# Altium schematic sheet Sheet2.SchDoc
size A3; SheetNumber: 1; SheetTotal: 1
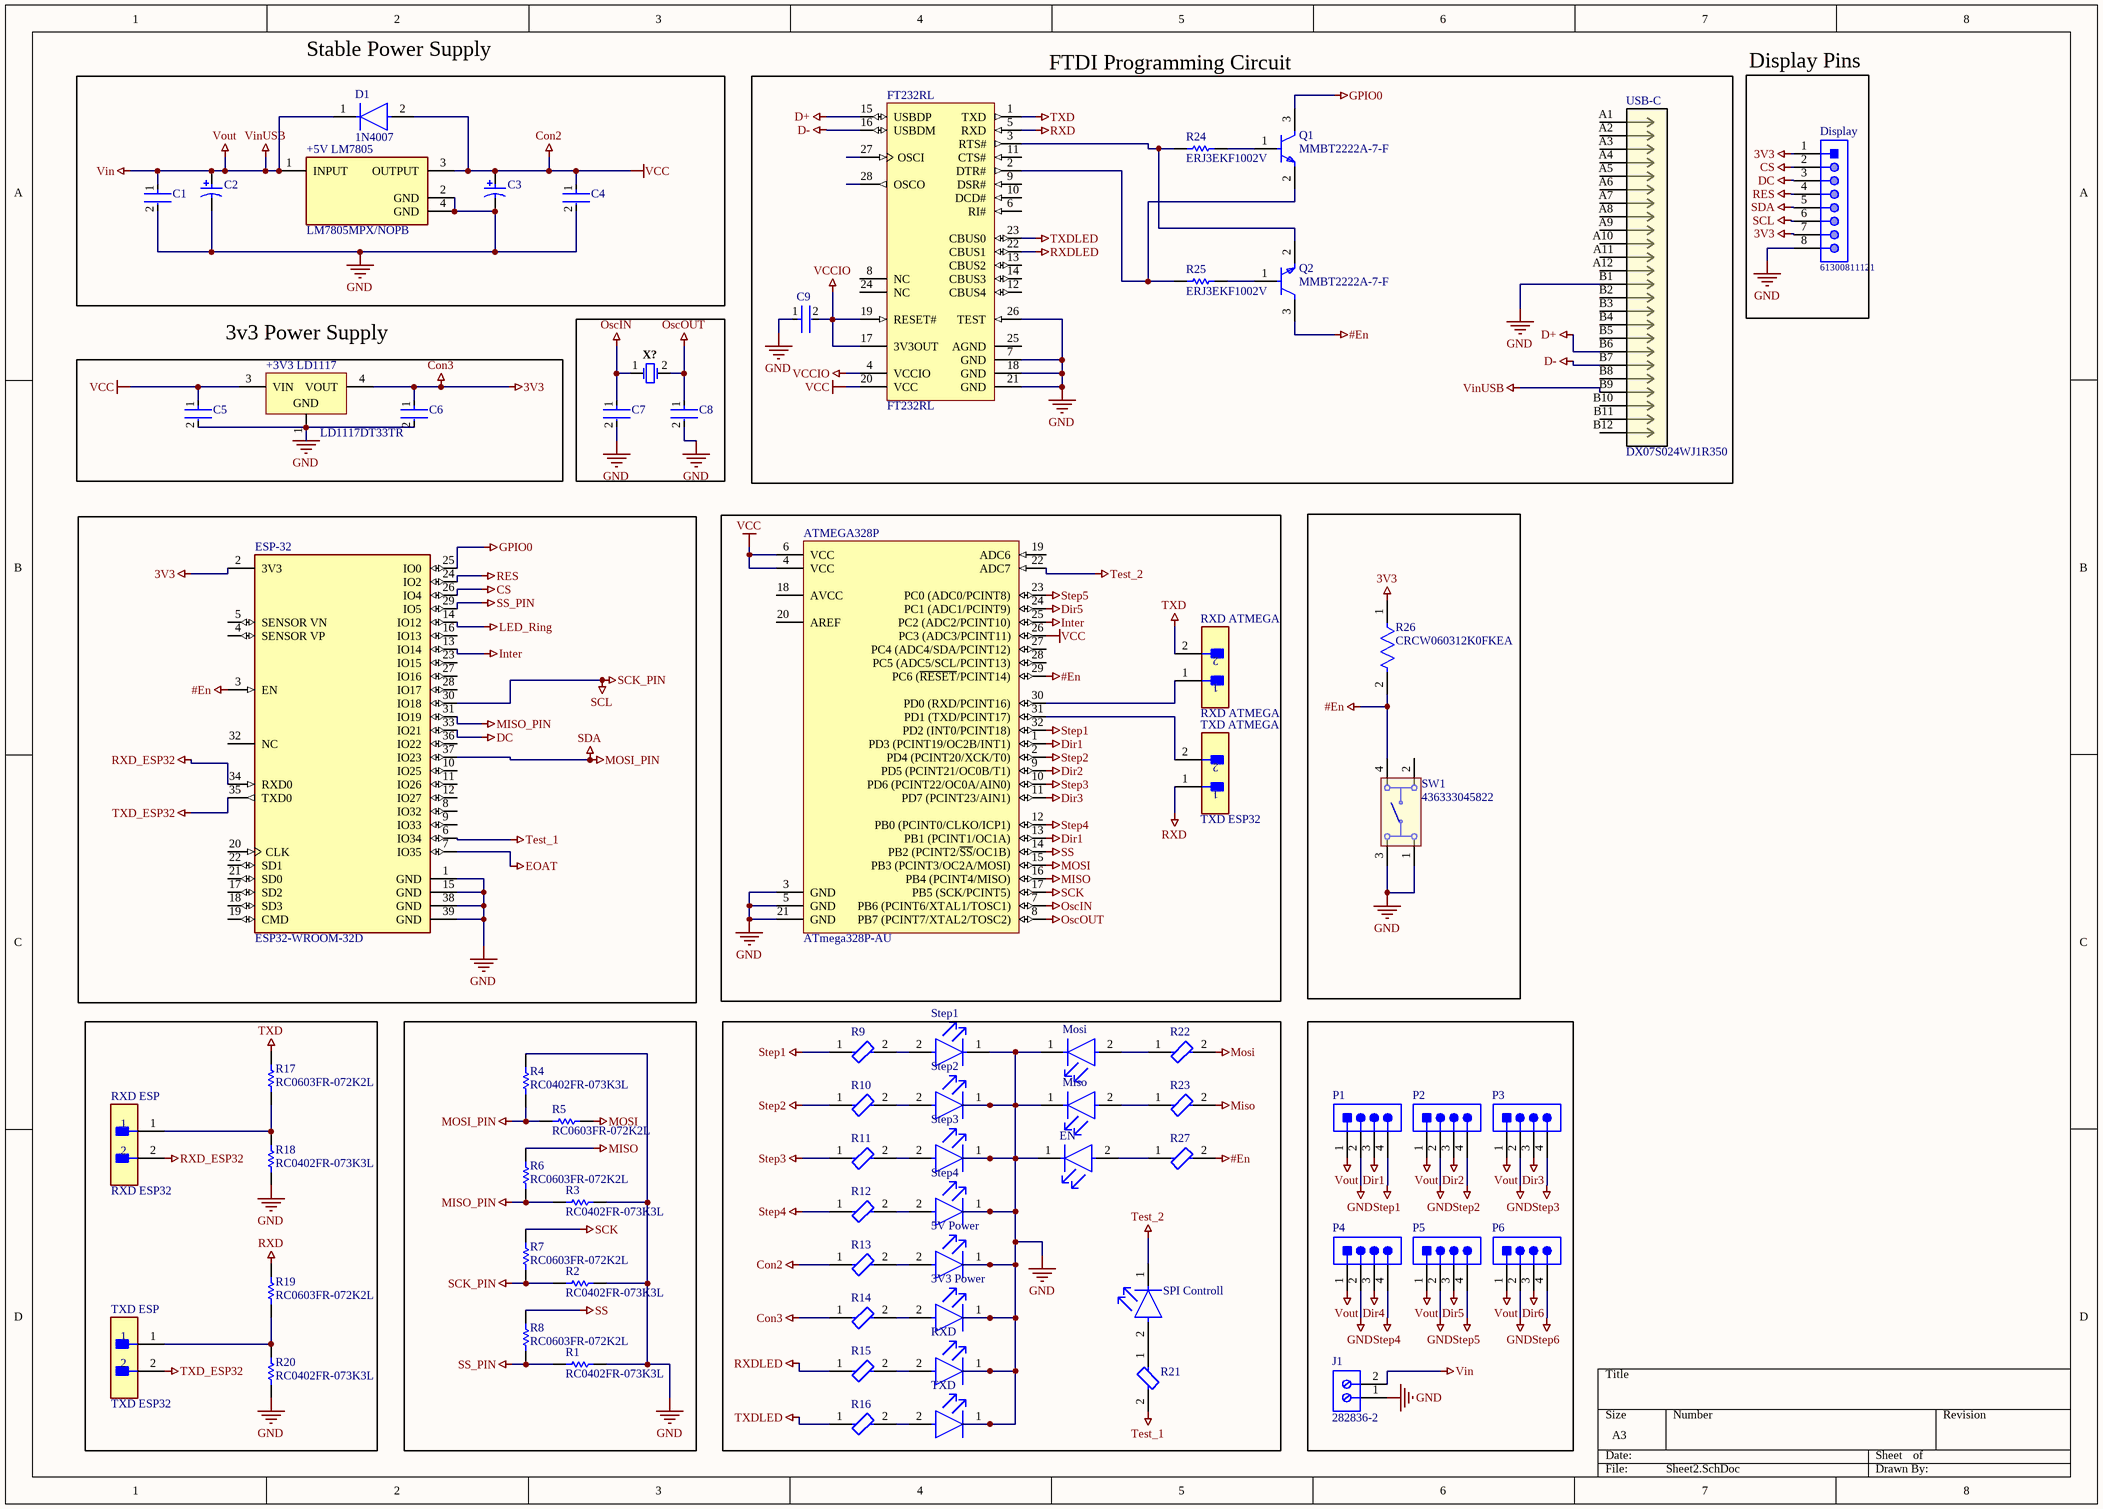
[diagram p0: Sheet2.SchDoc]

## Parts
3V3_Power  (no value)  [FP-150080SS75000-MFG]
5V_Power  (no value)  [FP-150080SS75000-MFG]
+3V3_LD1117  LD1117DT33TR  [TO-252_N]
+5V_LM7805  LM7805MPX/NOPB  [FP-LM7805MPX-NOPB-MFG]
ATMEGA328P  ATmega328P-AU  [32A_M]
C1  (no value)  [FP-CGA3E-0_3-0_1-IPC_A]
C2  (no value)  [NIC-UCL-10x13.5-2_V]
C3  (no value)  [NIC-UCL-10x13.5-2_V]
C4  (no value)  [FP-CGA3E-0_3-0_1-IPC_A]
C5  (no value)  [FP-CGA3E-0_3-0_1-IPC_A]
C6  (no value)  [FP-CGA3E-0_3-0_1-IPC_A]
C7  (no value)  [FP-C0603C-CF-MFG]
C8  (no value)  [FP-C0603C-CF-MFG]
C9  (no value)  [FP-CGA3E-0_3-0_1-IPC_A]
D1  1N4007  [FP-1N4007-MFG]
Display  61300811121  [61300811121]
EN  (no value)  [FP-150080SS75000-MFG]
ESP-32  ESP32-WROOM-32D  [FP-ESP32-WROOM-32D-MFG]
FT232RL  FT232RL  [FTDI-SSOP-28_M]
J1  282836-2  [TECO-282836-2_V]
Miso  (no value)  [FP-150080SS75000-MFG]
Mosi  (no value)  [FP-150080SS75000-MFG]
P1  (no value)  [JST-B4B-PH-K-S_V]
P2  (no value)  [JST-B4B-PH-K-S_V]
P3  (no value)  [JST-B4B-PH-K-S_V]
P4  (no value)  [JST-B4B-PH-K-S_V]
P5  (no value)  [JST-B4B-PH-K-S_V]
P6  (no value)  [JST-B4B-PH-K-S_V]
Q1  MMBT2222A-7-F  [FP-SOT23-IPC_A]
Q2  MMBT2222A-7-F  [FP-SOT23-IPC_A]
R1  RC0402FR-073K3L  [RESC1005X40X25ML05T10]
R2  RC0402FR-073K3L  [RESC1005X40X25ML05T10]
R3  RC0402FR-073K3L  [RESC1005X40X25ML05T10]
R4  RC0402FR-073K3L  [RESC1005X40X25ML05T10]
R5  RC0603FR-072K2L  [RESC1608X55X25LL10T15]
R6  RC0603FR-072K2L  [RESC1608X55X25LL10T15]
R7  RC0603FR-072K2L  [RESC1608X55X25LL10T15]
R8  RC0603FR-072K2L  [RESC1608X55X25LL10T15]
R9  (no value)  [FP-BLM18-0_15-t0_5-MFG]
R10  (no value)  [FP-BLM18-0_15-t0_5-MFG]
R11  (no value)  [FP-BLM18-0_15-t0_5-MFG]
R12  (no value)  [FP-BLM18-0_15-t0_5-MFG]
R13  (no value)  [FP-BLM18-0_15-t0_5-MFG]
R14  (no value)  [FP-BLM18-0_15-t0_5-MFG]
R15  (no value)  [FP-BLM18-0_15-t0_5-MFG]
R16  (no value)  [FP-BLM18-0_15-t0_5-MFG]
R17  RC0603FR-072K2L  [RESC1608X55X25LL10T15]
R18  RC0402FR-073K3L  [RESC1005X40X25ML05T10]
R19  RC0603FR-072K2L  [RESC1608X55X25LL10T15]
R20  RC0402FR-073K3L  [RESC1005X40X25ML05T10]
R21  (no value)  [FP-BLM18-0_15-t0_5-MFG]
R22  (no value)  [FP-BLM18-0_15-t0_5-MFG]
R23  (no value)  [FP-BLM18-0_15-t0_5-MFG]
R24  ERJ3EKF1002V  [RESC1609X55X30LL15T15]
R25  ERJ3EKF1002V  [RESC1609X55X30LL15T15]
R26  CRCW060312K0FKEA  [FP-CRCW0603-e3-IPC_A]
R27  (no value)  [FP-BLM18-0_15-t0_5-MFG]
RXD  (no value)  [FP-150080SS75000-MFG]
RXD_ATMEGA  RXD ATMEGA  [FP-M22-2510205-MFG]
RXD_ESP  RXD ESP32  [FP-M22-2510205-MFG]
SPI_Controll  (no value)  [FP-150080SS75000-MFG]
Step1  (no value)  [FP-150080SS75000-MFG]
Step2  (no value)  [FP-150080SS75000-MFG]
Step3  (no value)  [FP-150080SS75000-MFG]
Step4  (no value)  [FP-150080SS75000-MFG]
SW1  436333045822  [436333045822]
TXD  (no value)  [FP-150080SS75000-MFG]
TXD_ATMEGA  TXD ESP32  [FP-M22-2510205-MFG]
TXD_ESP  TXD ESP32  [FP-M22-2510205-MFG]
USB-C  DX07S024WJ1R350  [CONN_DX07S024WJ1R350_JAE]
X?  (no value)  [FOX-FOXSLF160-20]

## Blocks framed on the sheet
Stable Power Supply: +5V_LM7805 C1-C4 D1
FTDI Programming Circuit: C9 FT232RL Q1 Q2 R24 R25 USB-C
Display Pins: Display
3v3 Power Supply: +3V3_LD1117 C5 C6

## Nets
3V3: +3V3_LD1117.4(VOUT) C6.1 Display.1 Display.7 ESP-32.2(3V3) R14.1 R26.1  [also labelled Con3]
#En: ATMEGA328P.29(PC6_(~{RESET}/PCINT14)) ESP-32.3(EN) Q2.3(C) R26.2 R27.2 SW1.4
Con2: +3V3_LD1117.3(VIN) +5V_LM7805.3(OUTPUT) ATMEGA328P.4(VCC) ATMEGA328P.6(VCC) ATMEGA328P.26(PC3_(ADC3/PCINT11)) C3.1 C4.1 C5.1 D1.2(A) FT232RL.20(VCC) R13.1  [also labelled VCC]
CS: Display.2 ESP-32.26(IO4)
D+: FT232RL.15(USBDP) USB-C.B6(B4)
D-: FT232RL.16(USBDM) USB-C.B7(A10)
DC: Display.3 ESP-32.33(IO21)
Dir1: ATMEGA328P.1(PD3_(PCINT19/OC2B/INT1)) ATMEGA328P.13(PB1_(PCINT1/OC1A)) P1.3
Dir2: ATMEGA328P.9(PD5_(PCINT21/OC0B/T1)) P2.3
Dir3: ATMEGA328P.11(PD7_(PCINT23/AIN1)) P3.3
Dir4: P4.3
Dir5: ATMEGA328P.24(PC1_(ADC1/PCINT9)) P5.3
Dir6: P6.3
EOAT: ESP-32.7(IO35)
GND: 3V3_Power.1(C) 5V_Power.1(C) +3V3_LD1117.1(GND) +5V_LM7805.2(GND) +5V_LM7805.4(GND) ATMEGA328P.3(GND) ATMEGA328P.5(GND) ATMEGA328P.21(GND) C1.2 C2.2 C3.2 C4.2 C5.2 C6.2 C7.2 C8.2 C9.1 Display.8 EN.1(C) ESP-32.1(GND) ESP-32.15(GND) ESP-32.38(GND) ESP-32.39(GND) FT232RL.7(GND) FT232RL.18(GND) FT232RL.21(GND) FT232RL.26(TEST) J1.1 Miso.1(C) Mosi.1(C) P1.2 P2.2 P3.2 P4.2 P5.2 P6.2 R1.2 R2.2 R3.2 R4.2 RXD.1(C) Step1.1(C) Step2.1(C) Step3.1(C) Step4.1(C) SW1.1 SW1.3 TXD.1(C) USB-C.B1(A7)
GPIO0: ESP-32.25(IO0) Q1.3(C)
Inter: ATMEGA328P.25(PC2_(ADC2/PCINT10)) ESP-32.13(IO14)
LED_Ring: ESP-32.14(IO12)
MISO: ATMEGA328P.16(PB4_(PCINT4/MISO)) R6.2 R23.2
MISO_PIN: ESP-32.31(IO19) R3.1 R6.1
MOSI: ATMEGA328P.15(PB3_(PCINT3/OC2A/MOSI)) R5.2 R22.2
MOSI_PIN: Display.5 ESP-32.37(IO23) R4.1 R5.1  [also labelled SDA]
OscIN: ATMEGA328P.7(PB6_(PCINT6/XTAL1/TOSC1)) C7.1 X?.1
OscOUT: ATMEGA328P.8(PB7_(PCINT7/XTAL2/TOSC2)) C8.1 X?.2
RES: Display.4 ESP-32.24(IO2)
RXD: FT232RL.5(RXD) TXD_ATMEGA.1
RXD_ESP32: ESP-32.34(RXD0) RXD_ESP.2
RXDLED: FT232RL.22(CBUS1) R15.1
SCK: ATMEGA328P.17(PB5_(SCK/PCINT5)) R7.2
SCK_PIN: Display.6 ESP-32.30(IO18) R2.1 R7.1  [also labelled SCL]
SS: ATMEGA328P.14(PB2_(PCINT2/~{SS}/OC1B)) R8.2
SS_PIN: ESP-32.29(IO5) R1.1 R8.1
Step1: ATMEGA328P.32(PD2_(INT0/PCINT18)) P1.4 R9.1
Step2: ATMEGA328P.2(PD4_(PCINT20/XCK/T0)) P2.4 R10.1
Step3: ATMEGA328P.10(PD6_(PCINT22/OC0A/AIN0)) P3.4 R11.1
Step4: ATMEGA328P.12(PB0_(PCINT0/CLKO/ICP1)) P4.4 R12.1
Step5: ATMEGA328P.23(PC0_(ADC0/PCINT8)) P5.4
Step6: P6.4
Test_1: ESP-32.6(IO34) R21.2
Test_2: ATMEGA328P.22(ADC7) SPI_Controll.1(C)
TXD: FT232RL.1(TXD) RXD_ATMEGA.2
TXD_ESP32: ESP-32.35(TXD0) TXD_ESP.2
TXDLED: FT232RL.23(CBUS0) R16.1
VCCIO: C9.2 FT232RL.4(VCCIO) FT232RL.17(3V3OUT) FT232RL.19(RESET#)
Vin: +5V_LM7805.1(INPUT) C1.1 C2.1 D1.1(C) J1.2 P1.1 P2.1 P3.1 P4.1 P5.1 P6.1 USB-C.B9(A11)  [also labelled VinUSB, Vout]
Net3V3_Power_2: 3V3_Power.2(A) R14.2
Net5V_Power_2: 5V_Power.2(A) R13.2
NetATMEGA328P_30: ATMEGA328P.30(PD0_(RXD/PCINT16)) RXD_ATMEGA.1
NetATMEGA328P_31: ATMEGA328P.31(PD1_(TXD/PCINT17)) TXD_ATMEGA.2
NetEN_2: EN.2(A) R27.1
NetFT232RL_2: FT232RL.2(DTR#) Q1.2(E) R25.1
NetFT232RL_3: FT232RL.3(RTS#) Q2.2(E) R24.1
NetMiso_2: Miso.2(A) R23.1
NetMosi_2: Mosi.2(A) R22.1
NetQ1_1: Q1.1(B) R24.2
NetQ2_1: Q2.1(B) R25.2
NetR9_2: R9.2 Step1.2(A)
NetR10_2: R10.2 Step2.2(A)
NetR11_2: R11.2 Step3.2(A)
NetR12_2: R12.2 Step4.2(A)
NetR15_2: R15.2 RXD.2(A)
NetR16_2: R16.2 TXD.2(A)
NetR17_1: R17.1 R18.2 RXD_ESP.1
NetR19_1: R19.1 R20.2 TXD_ESP.1
NetR21_1: R21.1 SPI_Controll.2(A)

Not connected (* = marked no-connect by the designer): ATMEGA328P 18(AVCC) 19(ADC6) 20(AREF) 27(PC4_(ADC4/SDA/PCINT12)) 28(PC5_(ADC5/SCL/PCINT13)); ESP-32 4(SENSOR_VP) 5(SENSOR_VN) 8(IO32) 9(IO33) 10(IO25) 11(IO26) 12(IO27) 16(IO13) 17(SD2) 18(SD3) 19(CMD) 20(CLK) 21(SD0) 22(SD1) 23(IO15) 27(IO16) 28(IO17) 32(NC) 36(IO22); FT232RL 6(RI#) 8(NC) 9(DSR#) 10(DCD#) 11(CTS#) 12(CBUS4) 13(CBUS2) 14(CBUS3) 24(NC) 25(AGND) 27(OSCI) 28(OSCO); R17 2; R18 1; R19 2; R20 1; SW1 2; USB-C A1 A2(B12) A3(A2) A4(B11) A5(A3) A6(B10) A7(A4) A8(B9) A9(A5) A10(B8) A11(A6) A12(B7) B2(B6) B3(A8) B4(B5) B5(A9) B8(B3) B10(B2) B11(A12) B12(B1)

## Notes on the sheet
- Labels drawn without touching a wire or pin: GND, RXD, TXD

## Library data of the parts
3V3_Power 5V_Power EN Miso Mosi RXD SPI_Controll Step1-Step4 TXD = CMP-1426-00010-2: LED RED CLEAR 0805 SMD; Forward Voltage: 1.9V; Luminous Intensity: 60mcd; Dominant Wavelength: 630nm; Forward Current: 30mA; Viewing Angle: 140°; Lens Color: Colorless; Test Current: 20mA; Lens Size: 1.25mm; Packaging: Cut Tape; Width: 1.25mm; Case Code (Metric): 2012; Max Operating Temperature: 85°C; RoHS Compliant: Yes; Mount: Surface Mount; Case/Package: 0805; Series: WL-SMCW; Length: 2mm; Case Code (Imperial): 0805; Wavelength: 630nm; Lens Style: Clear; Min Operating Temperature: -40°C; Color: Red; Lens Transparency: Clear; Package Quantity: 1; Height: 0.8mm
+3V3_LD1117 = CMP-0244-00088-1: Fixed Low Drop Positive Voltage Regulator, 3.3V, 3-Pin DPAK, Tape and Reel; ComponentLink1Description: Manufacturer URL; PackageVersion: 2011; PackageReference: TO-252; ComponentLink2Description: Datasheet; ComponentLink1URL: http://www.st.com; DatasheetVersion: 1/11/2011; PackageDescription: 3-Pin Transistor Outline Package 2.28 mm Pitch, 9.7 mm Lead Span (DPAK); ComponentLink2URL: http://www.st.com/internet/com/TECHNICAL_RESOURCES/TECHNICAL_LITERATURE/DATASHEET/CD00000544.pdf
+5V_LM7805 = CMP-04917-000022-1: IC REG LINEAR 5V 1.5A SOT223-4; Manufacturer: Texas Instruments; Dropout Voltage: 2V; Output Type: Fixed; Accuracy Percentage: 3%; Nominal Supply Current: 8mA; Standoff Height: 0.02mm; Min Supply Voltage: 7.5V; Number Of Outputs: 1; Max Junction Temp: +150°C; Max Supply Voltage: 30V; Height: 1.8mm; Temperature Range High: +125°C; Device Class L3: Voltage Regulators - Linear; Lead Free: Yes; Digikey Description: IC REG LINEAR 5V 1.5A SOT223-4; Output Current: 1.5A; Manufacturer Part Number: LM7805MPX/NOPB; Automotive: No; Device Class L1: Integrated Circuits (ICs); ComponentLink2Description: Datasheet; Device Class L2: Power Management ICs; Category: IC; Octopart: https://octopart.com/lm7805mpx%2Fnopb-texas+instruments-74629992; Package: SOT223-4; RoHS: TRUE; Output Voltage: 5V; Temperature Range Low: 0°C; Temperature: 0°C to +125°C; ComponentLink2URL: http://www.ti.com/lit/ds/symlink/lm7800.pdf
ATMEGA328P = CMP-0095-00269-2: 8-bit AVR Microcontroller, 32KB Flash, 1KB EEPROM, 2KB SRAM, 32-pin TQFP, Industrial Grade (-40°C to 85°C); PackageDescription: 32-Lead, 7x7x1.0 mm Body, 0.8mm Lead Pitch, Thin Profile Plastic Quad Flat Package (TQFP); DatasheetVersion: revD, May-2011; RevisionNote: DatasheetVersion & PackageVersion updated. URLs added.; ComponentLink1URL: http://www.atmel.com/; ComponentLink2Description: ATmega48A/48PA/88A/88PA/168A/168PA/328/328P Datasheet; Code_JEDEC: MS-026-ABA; ComponentLink1Description: Manufacturer URL; PackageReference: 32A; ComponentLink3Description: ATmega48A/48PA/88A/88PA/168A/168PA/328/328P Summary; ComponentLink2URL: http://www.atmel.com/dyn/resources/prod_documents/doc8271.pdf; PackageVersion: revC, Oct-2010; ComponentLink3URL: http://www.atmel.com/dyn/resources/prod_documents/8271S.pdf
C1 C4-C6 C9 = CMP-2000-07546-2: Cap Ceramic 100nF 50V X7R 10% Pad SMD 0603 +125°C Automotive T/R; Weight: 7.1E-05oz; Composition: Ceramic; Max Operating Temperature: 125°C; Termination: SMD/SMT; Dielectric: X7R; Length: 1.6mm; Package Quantity: 1; REACH SVHC: No SVHC; Lead Free: Lead Free; Case Code (Metric): 1608; Min Operating Temperature: -55°C; Packaging: Tape and Reel; Tolerance: 10%; Voltage Rating: 50V; Case Code (Imperial): 0603; Capacitance: 100nF; Case/Package: 0603; Voltage Rating (DC): 50V; Depth: 0.8mm; Radiation Hardening: No; Ratings: AEC-Q200; Mount: Surface Mount; Voltage: 50V; Thickness: 0.035inch; Width: 0.8mm; Height: 0.8mm
C2 C3 = CMP-0926-00001-1: Aluminum Electrolytic Capacitor, Low Impedance, 1000 uF +/- 20%, 16 V, -55 to 105 degC, 2-Pin 10.3 x 10.3 x 13.5 mm SMD, RoHS, Reel; Manufacturer: Nichicon; PartNumber: UCL1C102MNL1GS; Rated Voltage: 16 V; Capacitance Tolerance: +/- 20%; Rated Capacitance: 1000 uF; Polarity Type: Polar; Impedance: 0.06 ohm; Leakage Current: 160 uA; Rated Ripple Current (at 100 kHz): 1190 mA; PackageReference: UCL-10x13.5-2; Mounting Technology: Surface Mount; PackageDescription: 2-Pin SMD, Body 10.3 x 10.3 mm, Height 14.3 mm; ComponentLink1Description: Manufacturer URL; ComponentLink2Description: Datasheet; RoHS: TRUE; DatasheetVersion: Sep-13; ComponentLink2URL: http://nichicon-us.com/english/products/pdfs/e-cl.pdf; ComponentLink1URL: www.nichicon.com; Packing: Reel; Category Temperature Range: -55 to 105 degC
C7 C8 = CMP-1035-00914-3: CAP CER 30PF 50V 5% NP0 0603; Manufacturer Part Number: C0603C300J5GACTU; Manufacturer: KEMET; Automotive Grade: Grade 1; Temperature Coefficient: 30ppm/°C; Material: Ceramic; Temperature Characteristic: C0G; Tolerance: 0.05; ComponentLink2URL: https://api.kemet.com/component-edge/download/datasheet/C0603C100J5GACAUTO.pdf; Automotive: Yes; Device Class L2: Capacitors; Device Class L1: Passive Components; Device Class L3: Ceramic Capacitors; RoHS: TRUE; Octopart: https://octopart.com/c0603c300j5gactu-kemet-199455; Lead Free: Yes; Value: 30 pF; Temperature Range High: +125°C; Category: Cap; Temperature: -55°C to +125°C; Package: C0603C-CF; Capacitance: 30 pF; Digikey Description: CAP CER 30PF 50V 5% NP0 0603; Height: 0.87mm; ComponentLink2Description: Datasheet; Temperature Range Low: -55°C; Mouser Description: Multilayer Ceramic Capacitors MLCC - SMD/SMT 50volts 30pF C0G 5%; Voltage Rating: 50 V
D1 = CMP-123542-000001-1: Rectifier diode 1000 V 1 A DO-41, ,; Manufacturer: Diotec; Max Surge Forward Current: 27A; Forward Current: 1A; Max Junction Temp: +175°C; Reverse Voltage: 1000V; Value: 15pF; Peak Reverse Current: 5uA; Category: Diode; Temperature Range Low: -50°C; Automotive: No; Temperature: -50°C to +175°C; Lead Free: Yes; ComponentLink2Description: Datasheet; Max Repetitive Reverse Voltage: 1000V; ComponentLink2URL: https://datasheet.octopart.com/1N4007-Diotec-datasheet-62346875.pdf; Manufacturer Part Number: 1N4007; Device Class L3: Rectifier Diodes; Height: 2.8mm; Octopart: https://octopart.com/1n4007-diotec-4040411; Package: 1N4007; Temperature Range High: +175°C; Device Class L1: Discrete Semiconductors; Device Class L2: Diodes; RoHS: TRUE; Capacitance: 15pF; Ipc Land Pattern Name: DIOAD888W100L520D280
Display = CMP-1502-01076-1: THT Vertical Pin Header WR-PHD, Pitch 2.54 mm, Single Row, 8 pins; Manufacturer: Wurth Elektronik; Rated Current: 3A; Pin Number: 8; Working Voltage: 250VAC; Gender: Male; Contact Resistance: 20mOhm; Pitch: 2.54mm; Withstanding Voltage: 500VAC; Publisher: WurthElektronik; Operating Temperature: -40to105degC; Orientation: Vertical; Row Number: Single; Part Number: 61300811121; Package Reference: 61300811121; Mounting Technology: THT; Packaging: Bag; Manufacturer URL: http://www.we-online.de; Datasheet URL: https://katalog.we-online.de/em/datasheet/6130xx11121.pdf
ESP-32 = CMP-194065-000003-1: WIFI MODULE 32MBITS SPI FLASH; Manufacturer: Espressif Systems; Max Supply Voltage: 3.6V; Nominal Supply Current: 500mA; Max Frequency: 2484MHz; Number Of Adc Channels: 16; Number Of Gpio: 32; Interface: I2C,SPI,UART,Ethernet,I2S,Other; Data Rate: 150Mbits/s; Min Supply Voltage: 3V; Bandwidth: 72MHz; Sensitivity: -98dBm; Octopart: https://octopart.com/esp32-wroom-32d-espressif+systems-91040050; Package: ESP32-WROOM-32D; ComponentLink2URL: https://www.espressif.com/sites/default/files/documentation/esp32-wroom-32d_esp32-wroom-32u_datasheet_en.pdf; Lead Free: Yes; Category: UNK; Mouser Description: Wi-Fi/BT BLE Module ESP32-D0WD, SPI Flash, UART, P; Device Class L1: Integrated Circuits (ICs); RoHS: TRUE; Temperature Range Low: -40°C; ComponentLink2Description: Datasheet; Digikey Description: WIFI MODULE 32MBITS SPI FLASH; Height: 3.2mm; Temperature: -40°C to +85°C; Manufacturer Part Number: ESP32-WROOM-32D; Device Class L3: Transceivers; Device Class L2: RF Semiconductors and Devices; Temperature Range High: +85°C; Automotive: No
FT232RL = CMP-2000-05029-1: IC USB FS SERIAL UART 28-SSOP; Manufacturer: FTDI; Receive FIFO: 256B; Number of Channels per Chip: 1; Maximum Data Rate: 3MBd; Transmit FIFO: 128B; Dimensions: 10.2x5.3x1.75mm; Mounting Type: SurfaceMount; Height: 1.75mm; Package Type: SSOP; Datasheet Version: Rev. 1.04, 02/2006; Width: 5.3mm; Manufacturer URL: http://www.ftdichip.com/; Datasheet URL: http://datasheet.octopart.com/FT232RL-FTDI-datasheet-120501.pdf; Maximum Operating Temperature: +85degC; Minimum Operating Temperature: -40degC; Pin Count: 28; Length: 10.2mm
J1 = CMP-1684-00017-1: Female Header, Pitch 5 mm, 1 x 2 Position, Height 10 mm, Tail Length 3.5 mm, Rohs, Bulk; Manufacturer: TE Connectivity; Wire Gauge: 16-30AWG; Product Training Modules: Wire-to-BoardEurostyleTerminalBlocks; Clamp Material - Plating: Brass-NickelPlated; Voltage: 300V; Mating Orientation: HorizontalwithBoard; Current: 13.5A; Pitch: 0.197"(5.00mm); Screw Thread: M3; 3D Model: 282836-2.pdf; Other Names: 5ULV-02B / A98076; Dynamic Catalog: BuchananSeries; Number of Levels: 1; Torque - Screw: 0.68Nm(6Lb-In); Featured Product: EurostyleTerminalBlockConnectors; Positions Per Level: 2; Wire Termination: Screw-RisingCageClamp; Datasheet URL: http://www.te.com.cn/commerce/DocumentDelivery/DDEController?Action=showdoc&DocId=Catalog+Section%7F1308389_EUROSTYLE_TERMINAL_BLOCKS%7F0607%7Fpdf%7FEnglish%7FENG_CS_1308389_EUROSTYLE_TERMINAL_BLOCKS_0607.pdf%7F282836-2; Color: Green; Family: TerminalBlocks-WiretoBoard; RoHS Information: 282836-2StatementofCompliance; Standard Package: 300; Contact Material - Plating: Brass-TinPlated; Manufacturer URL: http://www.te.com; Housing Material: Polyamide(PA66),Nylon6/6; Features: Interlocking(Side); Package Description: Female Header, Pitch 5 mm, 1 x 2 Position, Height 10 mm, Tail Length 3.5 mm; Mounting Type: ThroughHole; Package Reference: THD; Packaging: Bulk; Series: Buchanan; Category: Connectors,Interconnects; Screw Material - Plating: Brass-NickelPlated
P1-P6 = CMP-2000-05165-1: Male Header, Pitch 2 mm, 1 x 4 Position, Height 6 mm, Tail Length 3.4 mm, -25 to 85 degC, RoHS, Bulk; Manufacturer: JST; No of Positions: 4; Style/Orientation: StraightHeader/Plug; Pitch: 2mm; Datasheet URL: http://datasheet.octopart.com/B4B-PH-K-S%28LF%29%28SN%29-JST-datasheet-10558886.pdf; Type: ShroudedHeader; Manufacturer URL: http://www.jst.com/home2.html; Termination: Crimp; Datasheet Version: Apr-09
Q1 Q2 = CMP-1693-00003-4: TRANS NPN 40V 0.6A SMD SOT23-3; Number of Elements: 1; Frequency: 300MHz; Max Collector Current: 600mA; Collector Base Voltage (VCBO): 75V; Current: 1A; Element Configuration: Single; Power Dissipation: 350mW; hFE Min: 100; Collector Emitter Saturation Voltage: 1V; Max Power Dissipation: 300mW; Emitter Base Voltage (VEBO): 6V; Voltage: 40V; Collector Emitter Breakdown Voltage: 40V; Width: 1.4mm; Polarity: NPN; Termination: SMD/SMT; Max Operating Temperature: 150°C; Transition Frequency: 300MHz; Contact Plating: Tin; Mount: Surface Mount; Max Frequency: 300MHz; Case/Package: SOT-23; Gain Bandwidth Product: 300MHz; Lead Free: Lead Free; Collector Emitter Voltage (VCEO): 40V; Radiation Hardening: No; Voltage Rating (DC): 40V; Height: 1mm; Max Breakdown Voltage: 40V; Packaging: Tape and Reel; Length: 3.05mm; Min Operating Temperature: -55°C; Weight: 0.000282oz; Current Rating: 600mA; REACH SVHC: No SVHC; Package Quantity: 3000; Continuous Collector Current: 600mA; Number of Pins: 3
R1-R4 R18 R20 = CMP-2002-07652-1: Manufacturer: Yageo / Phycomp; Part Number: RC0402FR-073K3L
R5-R8 R17 R19 = CMP-2000-06934-1: Thick Film Resistor, 2.2 KOhm, 100 mW, 50 V, +/- 1%, -55 to 155 degC, 2-Pin SMD (0603), RoHS, Tape and Reel; Manufacturer: Yageo; Resistance: 2.2kOhms; Temperature Coefficient: 100PPM/C; Voltage Rating: 50V; Power Rating: 100mW; Tolerance: 1%; Datasheet Version: Rev. 7, 05/2017; Case Code - mm: 1608; Series: RC; Mounting Technology: SurfaceMount; Package Description: 2-Pin Surface Mount Device, Body 1.6 x 0.8 mm; Case Code - in: 0603; Package Reference: 0603; Product: ThickFilmResistorsGeneralPurpose; Manufacturer URL: http://www.yageo.com/; Termination Style: SMD/SMT; Operating Temperature Range: -55Cto+155C; Datasheet URL: http://www.yageo.com/documents/recent/PYu-RC_Group_51_RoHS_L_7.pdf; Packaging: Reel
R9-R16 R21-R23 R27 = CMP-0686-00596-3: Chip Ferrite Bead, 0603, 220Ω @ 100MHz, 25%, 0.04Ω, 2.5A; Impedance: 220R; DC Resistance-Max: 40mR; Number of Circuits: 1; Test Frequency: 100MHz; Material: Ferrite; Lead Free: Lead Free; Width: 0.8mm; Max Current Rating: 2.5A; Termination: SMD/SMT; Depth: 0.95mm; Packaging: Tape and Reel; Case Code (Metric): 1608; DC Current: 2.5A; Weight: 7.1E-05oz; Min Operating Temperature: -55°C; DC Resistance (DCR): 40mR; Max Operating Temperature: 125°C; Core Material: Ferrite; Max DC Current: 2.5A; Case/Package: 0603; REACH SVHC: No SVHC; Height: 0.8mm; Number of Pins: 2; Tolerance: 25%; RoHS Compliant: Yes; Radiation Hardening: No; Current Rating: 2.5A; Number of Lines: 1; Series: BLM18S; Case Code (Imperial): 0603; Length: 1.6mm; Package Quantity: 1
R24 R25 = CMP-1012-00623-3: Chip Resistor, 10 KOhm, +/- 1%, 0.1 W, -55 to 155 degC, 0603 (1608 Metric), RoHS, Tape and Reel; Manufacturer: Panasonic; Voltage Rating: 75V; Case\/Package: 0603; Power Rating: 100mW; Resistance: 10KOhm; Temperature Coefficient: 100ppm\/degreesC; Number of Pins: 2; Package Reference: 603; Depth: 0.8mm; Mount: SurfaceMount; Package Description: 2-Pin Surface Mount Device, Body 1.6 x 0.85 mm; Datasheet Version: 02/2017; Length: 1.6mm; Lead Free: LeadFree; Height: 0.45mm; Number of Terminations: 2; Max Power Dissipation: 100mW; Min Operating Temperature: -55degC; Datasheet URL: https://industrial.panasonic.com/cdbs/www-data/pdf/RDA0000/AOA0000C304.pdf; Termination: SMD/SMT; Case Code (Metric): 1608; Case Code (Imperial): 0603; Tolerance: 1%; Max Operating Temperature: 155degC; RoHSCompliant: true; Voltage Rating (DC): 75V; Radiation Hardening: No; Packaging: TapeandReel; Composition: ThickFilm; Mounting Technology: SurfaceMount; Manufacturer URL: http://www.panasonic.com/; Width: 0.031inch; REACH SVHC: NoSVHC; Contact Plating: Tin; Military Standard: Not; Package Quantity: 1
R26 = CMP-2000-03877-2: RES Thick Film, 12kΩ, 1%, 0.1W, 100ppm/°C, 0603; Resistance: 12kR; Voltage Rating: 75V; Power Rating: 100mW; Termination: SMD/SMT; Case Code (Metric): 1608; Max Operating Temperature: 155°C; Depth: 0.85mm; Width: 0.033inch; Military Standard: Not; Composition: Thick Film; Features: Automotive AEC-Q200; Lead Free: Lead Free; Weight: 7.1E-05oz; Mount: Surface Mount; Height: 0.45mm; Min Operating Temperature: -55°C; Tolerance: 1%; Case/Package: 0603; Temperature Coefficient: 100ppm/°C; Contact Plating: Tin; Voltage Rating (DC): 75V; Length: 1.55mm; Packaging: Tape and Reel; Case Code (Imperial): 0603; Max Power Dissipation: 100mW; Package Quantity: 10; Radiation Hardening: No; Number of Terminations: 2
RXD_ATMEGA RXD_ESP TXD_ATMEGA TXD_ESP = CMP-15831-000005-1: CONN HEADER VERT 2POS 2MM; Manufacturer: Harwin; Manufacturer Part Number: M22-2510205; Conn Gender: Male; Current Rating: 2A; Number Of Contacts: 2; Conn Orientation: Vertical; Temperature Range Low: -40°C; Device Class L1: Connectors; ComponentLink2URL: https://cdn.harwin.com/pdfs/C018XX_M22_Series_Connectors.pdf; Temperature Range High: +105°C; Pitch: 2mm; Number Of Rows: 1; Temperature: -40°C to +105°C; Automotive: No; Device Class L3: unset; Octopart: https://octopart.com/m22-2510205-harwin-2538221; Mouser Description: Headers & Wire Housings 2 PIN SIL VERTICAL GOLD PIN HEADER; Height: 5.45mm; Category: Conn; Digikey Description: CONN HEADER VERT 2POS 2MM; Contact Material: Gold,Nickel; Lead Free: Yes; ComponentLink2Description: Datasheet; Device Class L2: Headers and Wire Housings; Package: 0; Footprint Url: https://cdn.harwin.com/pdfs/M22-251.pdf; RoHS: TRUE
SW1 = CMP-1464-00001-1: WS-TASU J-Bend J-Bend SMD Tact Switch with boss design 4.7X3.5 mm side push; Manufacturer: Wuerth Elektronik; ComponentLink2URL: http://katalog.we-online.de/em/datasheet/436333045822.pdf; PackageReference: 436333045822; ComponentLink1Description: Manufacturer URL; ComponentLink1URL: http://www.we-online.com; PartNumber: 436333045822; ComponentLink2Description: Datasheet
USB-C = DX07S024WJ1R350: No Description Available; Mfr_Name: JAE Electronics; Copyright: Copyright (C) 2022 Ultra Librarian. All rights reserved.; Manufacturer_Part_Number: DX07S024WJ1R350; RefDes: RefDes; Type: DEV
X? = CMP-1749-00003-1: Resistance Weld Thru-Hole Crystal, 16 MHz, -20 to 70 degC, 2-Pin THD, RoHS, Bulk; Voltage Rating: 250 V; Tolerance: 1%; Resistance: 221 kohm; Case\Package: Axial; Power Rating: 250 mW; RoHSCompliant: true; Package Quantity: 200; Packaging: Bulk; Min Operating Temperature: -55 degC; DatasheetVersion: Mar-15; ComponentLink1URL: http://www.foxonline.com/; Max Operating Temperature: 155 degC; PackageReference: FOXSLF160-20; Mount: Through Hole; PackageDescription: 2-Pin Through Hole Device, Body 11.35 x 4.65 mm; ComponentLink1Description: Manufacturer URL; ComponentLink2URL: http://www.foxonline.com/pdfs/hc49slf.pdf; ComponentLink2Description: Datasheet; Length: 0.248 inch